# Altium schematic sheet Power.SchDoc
size A2
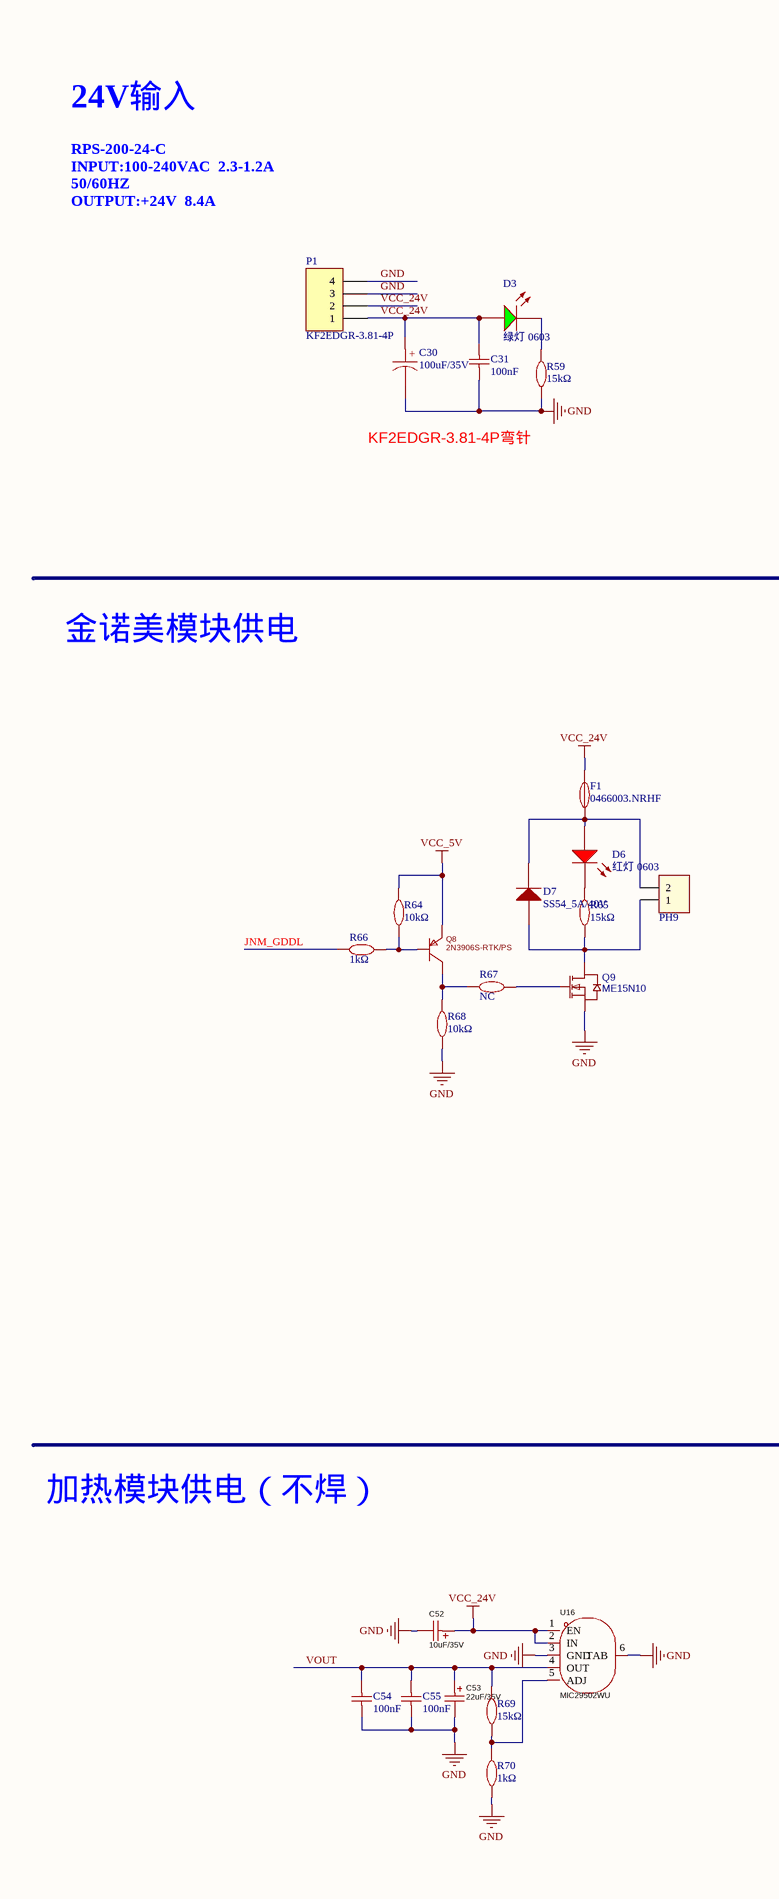
[diagram p0: Power.SchDoc, left]
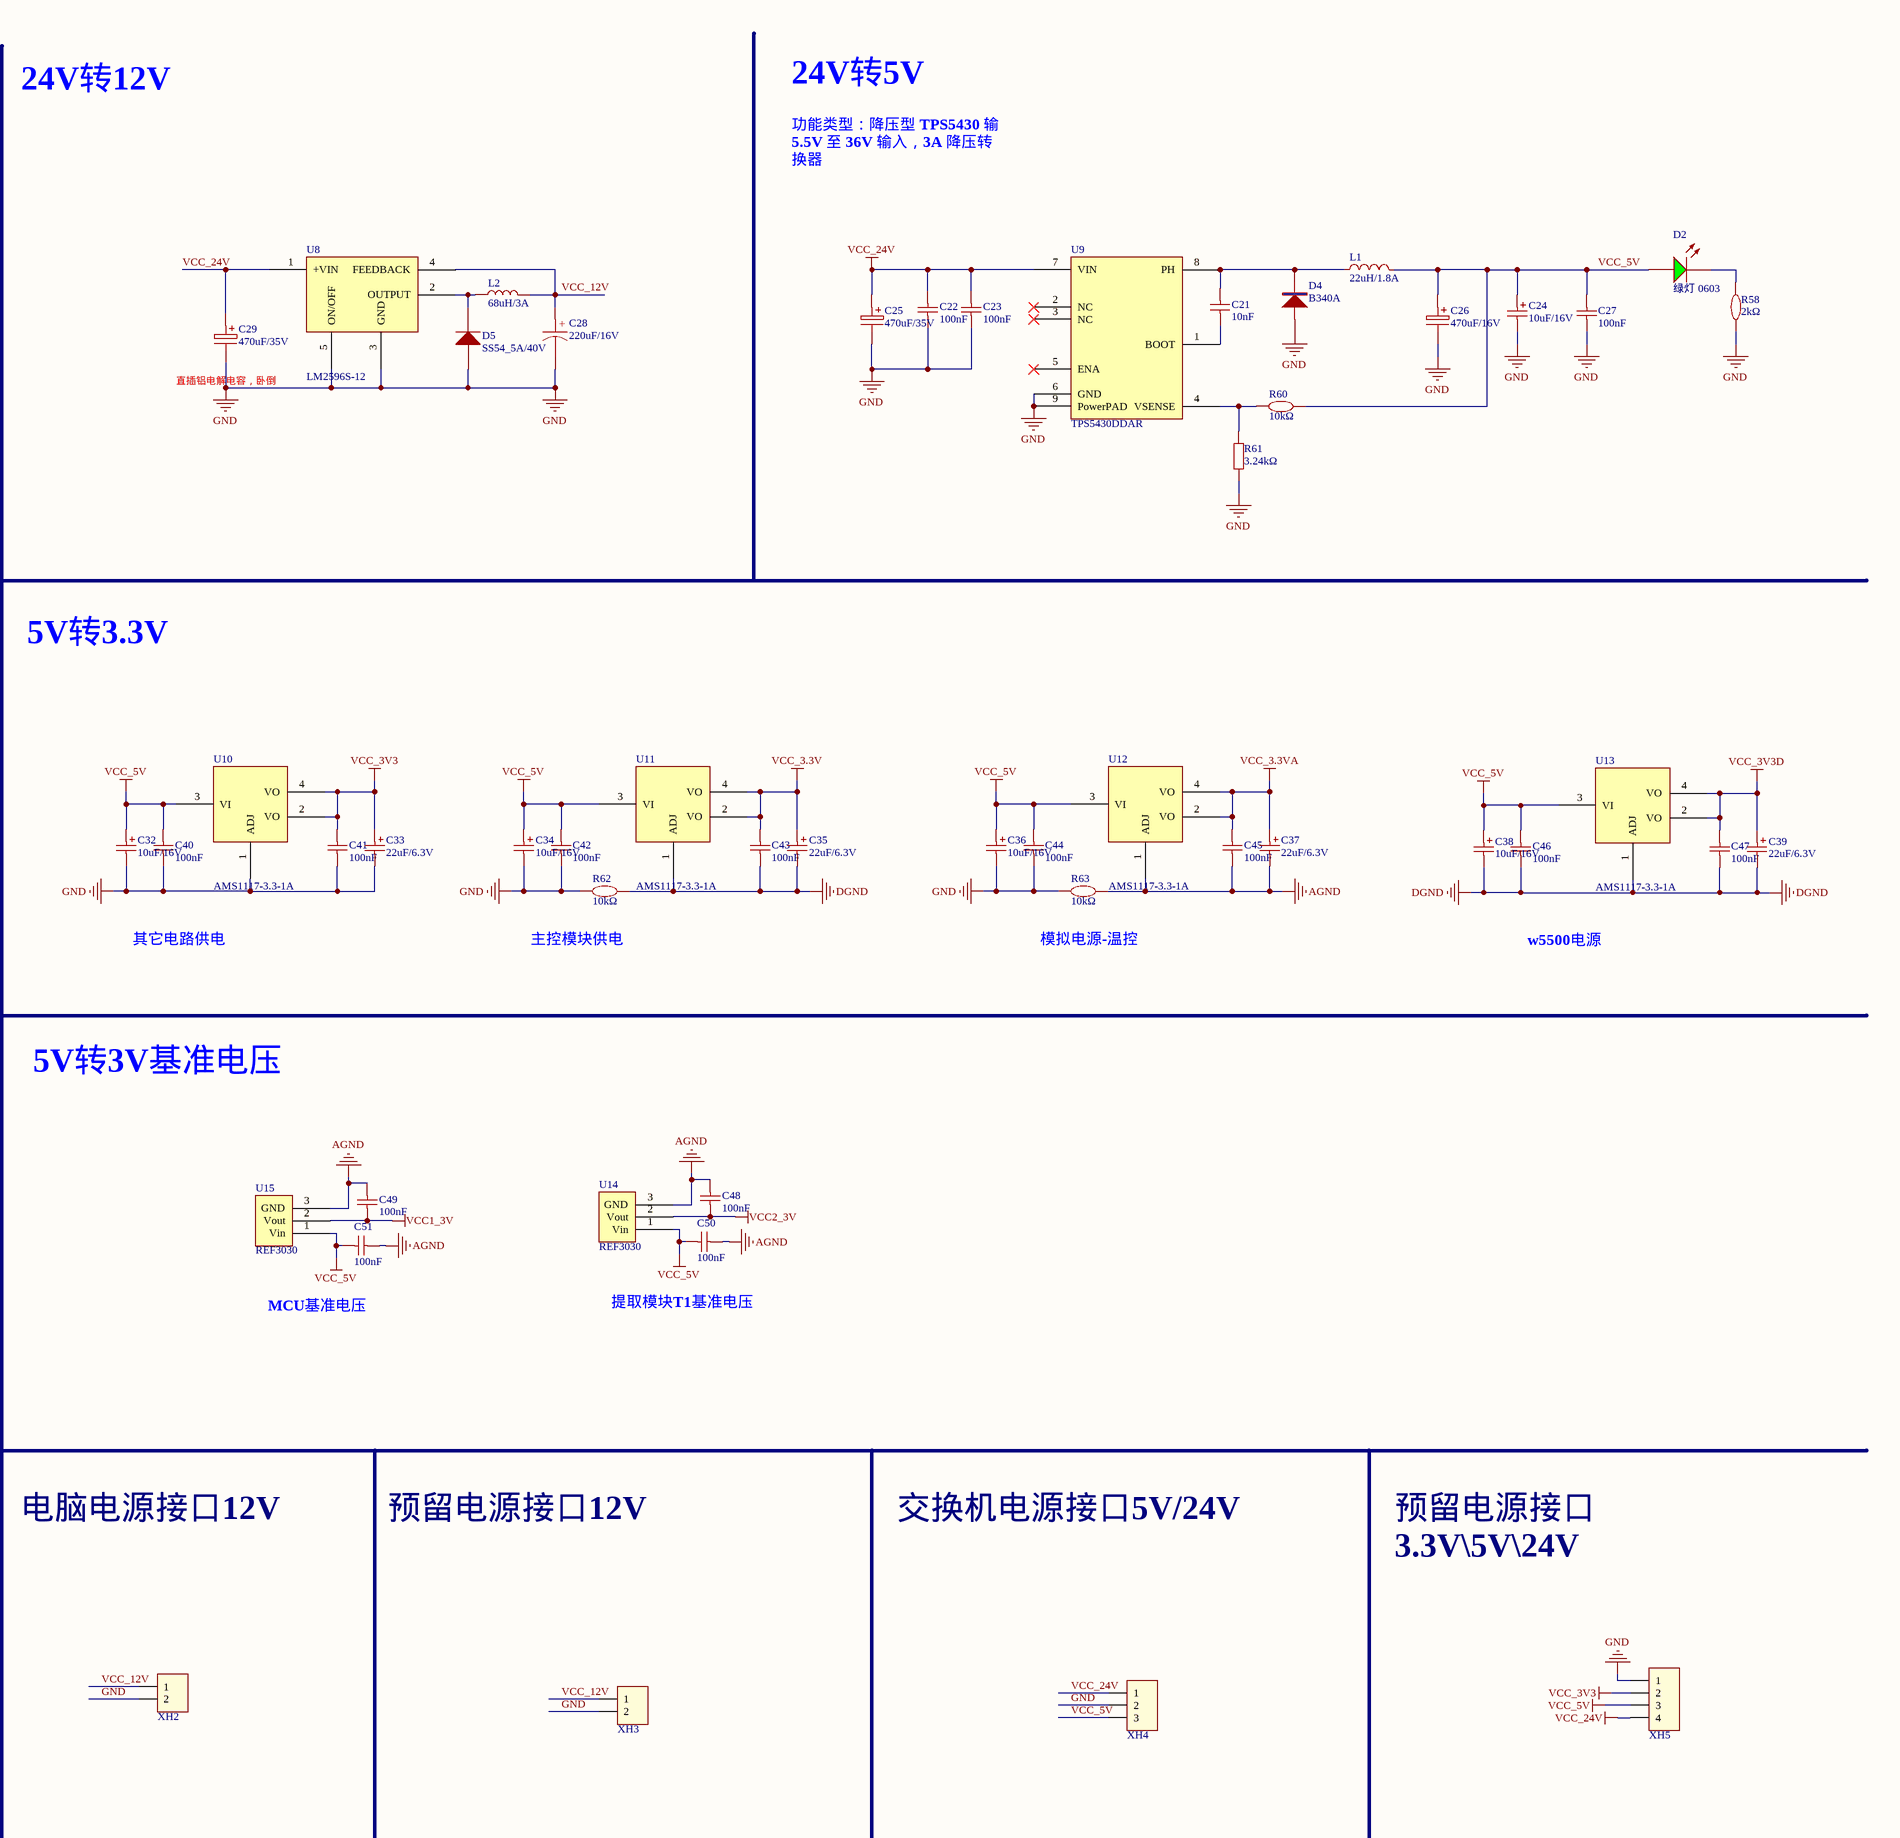
[diagram p1: Power.SchDoc, right]

## Parts
C21  10nF  [C0603]
C22  100nF  [C0603]
C23  100nF  [C0603]
C24  10uF/16V  [CASE-A_3216]
C25  470uF/35V  [ELE-S-10.5/D10]
C26  470uF/16V  [ELE-S-10.5/D8.0]
C27  100nF  [C0603]
C28  220uF/16V  [SMD-ECAP-6.3×7.7]
C29  470uF/35V  [ELE-S-10.5/D10]
C30  100uF/35V  [SMD-ECAP-6.3×7.7]
C31  100nF  [C0603]
C32  10uF/16V  [CASE-A_3216]
C33  22uF/6.3V  [CASE-A_3216]
C34  10uF/16V  [CASE-A_3216]
C35  22uF/6.3V  [CASE-A_3216]
C36  10uF/16V  [CASE-A_3216]
C37  22uF/6.3V  [CASE-A_3216]
C38  10uF/16V  [CASE-A_3216]
C39  22uF/6.3V  [CASE-A_3216]
C40  100nF  [C0603]
C41  100nF  [C0603]
C42  100nF  [C0603]
C43  100nF  [C0603]
C44  100nF  [C0603]
C45  100nF  [C0603]
C46  100nF  [C0603]
C47  100nF  [C0603]
C48  100nF  [C0603]
C49  100nF  [C0603]
C50  100nF  [C0603]
C51  100nF  [C0603]
C52  10uF/35V  [CASE-D_7343]
C53  22uF/35V  [CAP-SMD_L7.3-W4.3-RD]
C54  100nF  [C0805]
C55  100nF  [C0805]
D2  绿灯 0603  [LED_0603]
D3  绿灯 0603  [LED_0603]
D4  B340A  [D-SMA]
D5  SS54_5A/40V  [SMA(DO-214AC)_S5]
D6  红灯 0603  [LED_0603]
D7  SS54_5A/40V  [SMA(DO-214AC)_S5]
F1  0466003.NRHF  [F1206]
L1  22uH/1.8A  [L-6X6X4.5]
L2  68uH/3A  [SMD INDUCTOR 68uH 3A]
P1  KF2EDGR-3.81-4P  [KF2EDGK 3.81mm-4P]
PH9  PH2.0-2P  [PH2.0-2P 弯针]  (value not drawn)
Q8  2N3906S-RTK/PS  [SOT-23-3_L2.9-W1.3-P1.90-LS2.4-TR]
Q9  ME15N10  [TO-252-2_L6.6-W6.1-P4.57-LS9.9-TL-CW]
R58  2kΩ  [R0603]
R59  15kΩ  [R0603]
R60  10kΩ  [R0603]
R61  3.24kΩ  [R0603]
R62  10kΩ  [R1206]
R63  10kΩ  [R1206]
R64  10kΩ  [R0603]
R65  15kΩ  [R0603]
R66  1kΩ  [R0603]
R67  NC  [R0603]
R68  10kΩ  [R0603]
R69  15kΩ  [R1206]
R70  1kΩ  [R1206]
U8  LM2596S-12  [TO-263-5]
U9  TPS5430DDAR  [IC-SO8-PAD]
U10  AMS1117-3.3-1A  [LM1117I(SOT223)]
U11  AMS1117-3.3-1A  [LM1117I(SOT223)]
U12  AMS1117-3.3-1A  [LM1117I(SOT223)]
U13  AMS1117-3.3-1A  [LM1117I(SOT223)]
U14  REF3030  [SOT-23(SOT-23-3)]
U15  REF3030  [SOT-23(SOT-23-3)]
U16  MIC29502WU  [TO-263-5_L10.2-W9.9-P1.70-LS14.4-TL]
XH2  PH2.0-2P  [PH2.0-2P 弯针]  (value not drawn)
XH3  PH2.0-2P  [PH2.0-2P 弯针]  (value not drawn)
XH4  PH2.0-3P  [PH2.0-3P 弯针]  (value not drawn)
XH5  PH2.0-4P  [PH2.0-4P 弯针]  (value not drawn)

## Nets
AGND: C37.2 C45.1 C48.2 C49.2 C50.2 C51.2 R63.2 U12.1(ADJ) U14.3(GND) U15.3(GND)
DGND: C35.2 C38.2 C39.2 C43.1 C46.1 C47.1 R62.2 U11.1(ADJ) U13.1(ADJ)
GND: C22.1 C23.1 C24.2 C25.2 C26.2 C27.1 C28.2 C29.2 C30.2 C31.1 C32.2 C33.2 C34.2 C36.2 C40.1 C41.1 C42.1 C44.1 C52.2 C53.2 C54.1 C55.1 D4.1 D5.1(A) P1.3 P1.4 Q9.3(S) R58.2 R59.1 R61.1 R62.1 R63.1 R68.2 R70.2 U8.3(GND) U8.5(ON/OFF) U9.6(GND) U9.9(PowerPAD) U10.1(ADJ) U16.3(GND) U16.6(TAB) XH2.2 XH3.2 XH4.2 XH5.1
VCC1_3V: C49.1 U15.2(Vout)
VCC2_3V: C48.1 U14.2(Vout)
VCC_3.3V: C35.1 C43.2 U11.2(VO) U11.4(VO)
VCC_3.3VA: C37.1 C45.2 U12.2(VO) U12.4(VO)
VCC_3V3: C33.1 C41.2 U10.2(VO) U10.4(VO) XH5.2
VCC_3V3D: C39.1 C47.2 U13.2(VO) U13.4(VO)
VCC_5V: C24.1 C26.1 C27.2 C32.1 C34.1 C36.1 C38.1 C40.2 C42.2 C44.2 C46.2 C50.1 C51.1 D2.A L1.1 Q8.1(E) R60.1 R64.1 U10.3(VI) U11.3(VI) U12.3(VI) U13.3(VI) U14.1(Vin) U15.1(Vin) XH4.3 XH5.3
VCC_24V: C22.2 C23.2 C25.1 C29.1 C30.1 C31.2 C52.1 D3.A F1.2 P1.1 P1.2 U8.1(+VIN) U9.7(VIN) U16.1(EN) U16.2(IN) XH4.1 XH5.4
JNM_GDDL: R66.1
VCC_12V: C28.1 L2.2 U8.4(FEEDBACK) XH2.1 XH3.1
VOUT: C53.1 C54.2 C55.2 R69.1 U16.4(OUT)
NetC21_1: C21.1 U9.1(BOOT)
NetC21_2: C21.2 D4.2 L1.2 U9.8(PH)
NetD2_K: D2.K R58.1
NetD3_K: D3.K R59.2
NetD5_2: D5.2(K) L2.1 U8.2(OUTPUT)
NetD6_A: D6.A D7.2(K) F1.1 PH9.2
NetD6_K: D6.K R65.2
NetD7_1: D7.1(A) PH9.1 Q9.2(D) R65.1
NetQ8_2: Q8.2(B) R64.2 R66.2
NetQ8_3: Q8.3(C) R67.1 R68.1
NetQ9_1: Q9.1(G) R67.2
NetR60_2: R60.2 R61.2 U9.4(VSENSE)
NetR69_2: R69.2 R70.1 U16.5(ADJ)

Not connected (* = marked no-connect by the designer): U9 2(NC)* 3(NC)* 5(ENA)*

## Notes on the sheet
- 24V转5V
- 24V输入
- 24V转12V
- RPS-200-24-C
  INPUT:100-240VAC  2.3-1.2A
  50/60HZ
  OUTPUT:+24V  8.4A
- 功能类型：降压型 TPS5430 输5.5V 至 36V 输入，3A 降压转换器
- (near C29) 直插铝电解电容，卧倒
- KF2EDGR-3.81-4P弯针
- 5V转3.3V
- 金诺美模块供电
- 其它电路供电
- (near R62) 主控模块供电
- (near R63) 模拟电源-温控
- w5500电源
- 5V转3V基准电压
- MCU基准电压
- 提取模块T1基准电压
- 加热模块供电（不焊）
- 电脑电源接口12V
- 预留电源接口12V
- 交换机电源接口5V/24V
- 预留电源接口
  3.3V\5V\24V
- (in symbol 100uF/35V,SMD,6.3x7.7mm) +
- (in symbol 220uF/16V,SMD,D6.3x7.7mm) +

## Library data of the parts
C21 = 10nF/50V,C0603: 贴片电容,X7R; ComponentLink1Description: 供应商链接; ComponentLink1URL: http://www.szlcsc.com/product/details_16531.html
C22 C23 C27 C31 C40-C51 = 100nF/50V,C0603: 贴片电容,X7R; ComponentLink1Description: 供应商链接; ComponentLink1URL: http://www.szlcsc.com/product/details_16531.html
C24 C32 C34 C36 C38 = 10uF/16V,CASE-A_3216 : 钽电容;±10%;16V; ComponentLink1Description: 供应商链接; ComponentLink1URL: http://www.szlcsc.com/product/details_7643.html
C25 C29 = 470uF/35V,D10*10.5mm: 贴片型铝电解电容
C26 = 470uF/16V,D8*10.5mm: 贴片型铝电解电容
C28 = 220uF/16V,SMD,D6.3x7.7mm: 贴片型铝电解电容
C30 = 100uF/35V,SMD,6.3x7.7mm: 贴片型铝电解电容
C33 C35 C37 C39 = 22uF/6.3V,CASE-A_3216: 钽电容;±10%;6.3V; ComponentLink1Description: 供应商链接; ComponentLink1URL: http://www.szlcsc.com/product/details_7643.html
C52 = 10uF/35V,CASE-D-7343: TAJD106K035RNJ;钽电容;容值 10uF;精度 ±10%; 额定电压 35V;等效串联电阻(ESR) 1Ω@100kHz
C53 = 22uF/35V,CASE-D-7343: TAJD226K035RNJ;钽电容;容值 22uF; 精度 ±10%额定电压 35V;等效串联电阻(ESR) 900mΩ@100kHz
C54 C55 = 100nF/50V,C0805: 贴片电容,X7R; ComponentLink1Description: 供应商链接; ComponentLink1URL: http://www.szlcsc.com/product/details_16531.html
D2 D3 = 绿灯 0603: 发光二极管; ComponentLink1Description: 供应商链接; ComponentLink1URL: http://www.szlcsc.com/product/details_73152.html
D4 = B340A: 肖特基二极管；正向压降(Vf) 550mV@3A； 直流反向耐压(Vr) 40V； 整流电流 3A； 反向电流(Ir) 500uA@40V
D5 D7 = SS54_5A/40V: 肖特基二极管; ComponentLink1Description: Manufacturer Link; ComponentLink1URL: http://www.fairchildsemi.com/; ComponentLink2Description: Datasheet; ComponentLink2URL: http://www.fairchildsemi.com/ds/1N%2F1N4001.pdf
D6 = 红灯 0603: 发光二极管; ComponentLink1Description: 供应商链接; ComponentLink1URL: http://www.szlcsc.com/product/details_2659.html
F1 = 0466003.NRHF: 一次性贴片式保险丝；额定电流 3A；额定电压 (AC) 32V
L1 = 22uH/1.8A,L-6X6X4.5: SWPA6045S220MT;功率电感;SMD,6x6mm;电感值 22uH;精度 ±20%;额定电流 1.8A;饱和电流(Isat) 2.2A;直流电阻(DCR) 89mΩ
L2 = 68uH/3A,SMD,11.5x10mm: YSPI1050-680M;功率电感;电感值 68uH;精度 ±20%;额定电流 3A;直流电阻(DCR) 240mΩ
P1 = KF2EDGR-3.81-4P: C441184
Q8 = 2N3906S-RTK/PS: Manufacturer: KEC; Symbol: 2N3906S-RTK/PS_C5300004; Add into BOM: yes; Current - Collector(Ic): 200mA; Collector - Emitter Voltage VCEO: 40V; Pd - Power Dissipation: 350mW; DC Current Gain: 300@10mA,1V; Transition frequency(fT): 250MHz; Current - Collector Cutoff: 50nA; Vce Saturation(VCE(sat)): 400mV@50mA,5mA; Emitter-Base Voltage(Vebo): 5V; Device: 2N3906S-RTK/PS; LCSC Part Name: 2N3906S-RTK/PS; Supplier Part: C5300004; Manufacturer Part: 2N3906S-RTK/PS; Supplier Footprint: SOT-23; JLCPCB Part Class: Extended Part; Datasheet: https://item.szlcsc.com/datasheet/2N3906S-RTK%252FPS/6051230.html; Supplier: LCSC; Convert to PCB: yes
Q9 = ME15N10: 场效应管(MOSFET);N沟道
R58 = 2kΩ,R0603: 贴片电阻
R59 R65 = 15kΩ,R0603: 贴片电阻
R60 R64 R68 = 10kΩ,R0603: 电阻类型:厚膜电阻;阻值:10kΩ;精度:±1%;功率:100mW;最大工作电压:75V;温度系数:±100ppm/℃;
R61 = 3.24kΩ,R0603: 贴片电阻3.24KΩ;1%; ComponentLink1Description: 供应商链接; ComponentLink1URL: http://www.szlcsc.com/product/details_21904.html
R62 R63 = 0603WAF1002T5E: 贴片电阻
R66 = 1kΩ,R0603: 电阻类型:厚膜电阻;阻值:1kΩ;精度:±1%;功率:125mW;最大工作电压:150V;温度系数:±100ppm/℃;
R67 = NC,R0603
R69 = 15kΩ,R1206: 贴片电阻
R70 = 1kΩ,R1206: 贴片电阻
U9 = TPS5430DDAR: DC-DC电源芯片；降压型；可调； 工作电压 5.5V~36V；输出电压 1.221V~32.04V；输出电流 3A / 开关频率 500kHz
U10-U13 = AMS1117-3.3-1A: 800mA Low Dropout Regulator
U14 U15 = REF3030: REF3030AIDBZR/REF3030AIDBZT
U16 = MIC29502WU: 线性稳压器(LDO)